# Altium schematic sheet main.SchDoc: main
size A4; SheetNumber: 1; SheetTotal: 1
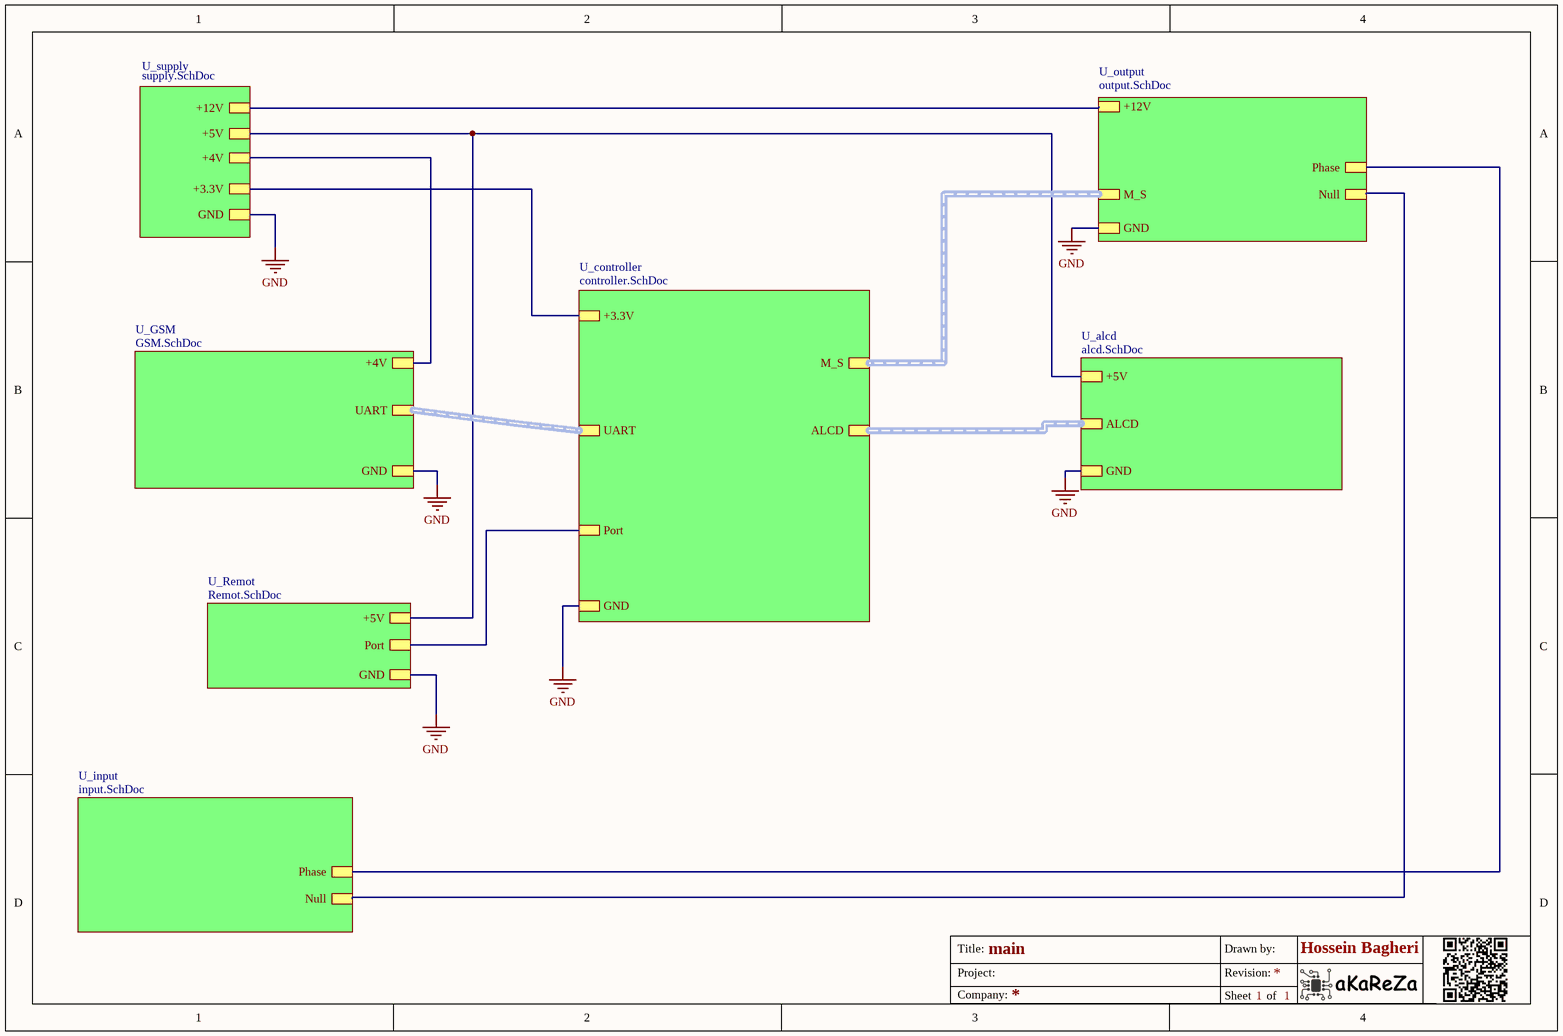
[diagram p0: main.SchDoc]

## Sub-sheets
U_alcd = alcd.SchDoc: GND, +5V, ALCD (harness aLCD)
U_controller = controller.SchDoc: GND, +3.3V, M_S (harness Motor signals), UART (harness UART), Port, ALCD (harness aLCD)
U_GSM = GSM.SchDoc: +4V, GND, UART (harness UART)
U_input = input.SchDoc: Null, Phase
U_output = output.SchDoc: +12V, GND, Phase, Null, M_S (harness Motor signals)
U_Remot = Remot.SchDoc: +5V, Port, GND
U_supply = supply.SchDoc: +4V, +3.3V, GND, +5V, +12V

## Nets
GND: sheet U_alcd/GND, sheet U_controller/GND, sheet U_GSM/GND, sheet U_output/GND, sheet U_supply/GND, sheet U_Remot/GND
(unnamed): sheet U_alcd/+5V, sheet U_supply/+5V, sheet U_Remot/+5V
(unnamed): sheet U_controller/+3.3V, sheet U_supply/+3.3V
(unnamed): sheet U_controller/Port, sheet U_Remot/Port
(unnamed): sheet U_GSM/+4V, sheet U_supply/+4V
(unnamed): sheet U_input/Null, sheet U_output/Null
(unnamed): sheet U_input/Phase, sheet U_output/Phase
(unnamed): sheet U_output/+12V, sheet U_supply/+12V

## Buses and harness runs
harness sheet U_alcd/ALCD = sheet U_controller/ALCD
harness sheet U_controller/M_S = sheet U_output/M_S
harness sheet U_controller/UART = sheet U_GSM/UART

## Notes on the sheet
- Title:
- Project:
- Drawn by:
- Revision:
- Hossein Bagheri
- Company:
- Sheet
- of